# EAGLE design BOTS_Latch (EAGLE 9.2.2)
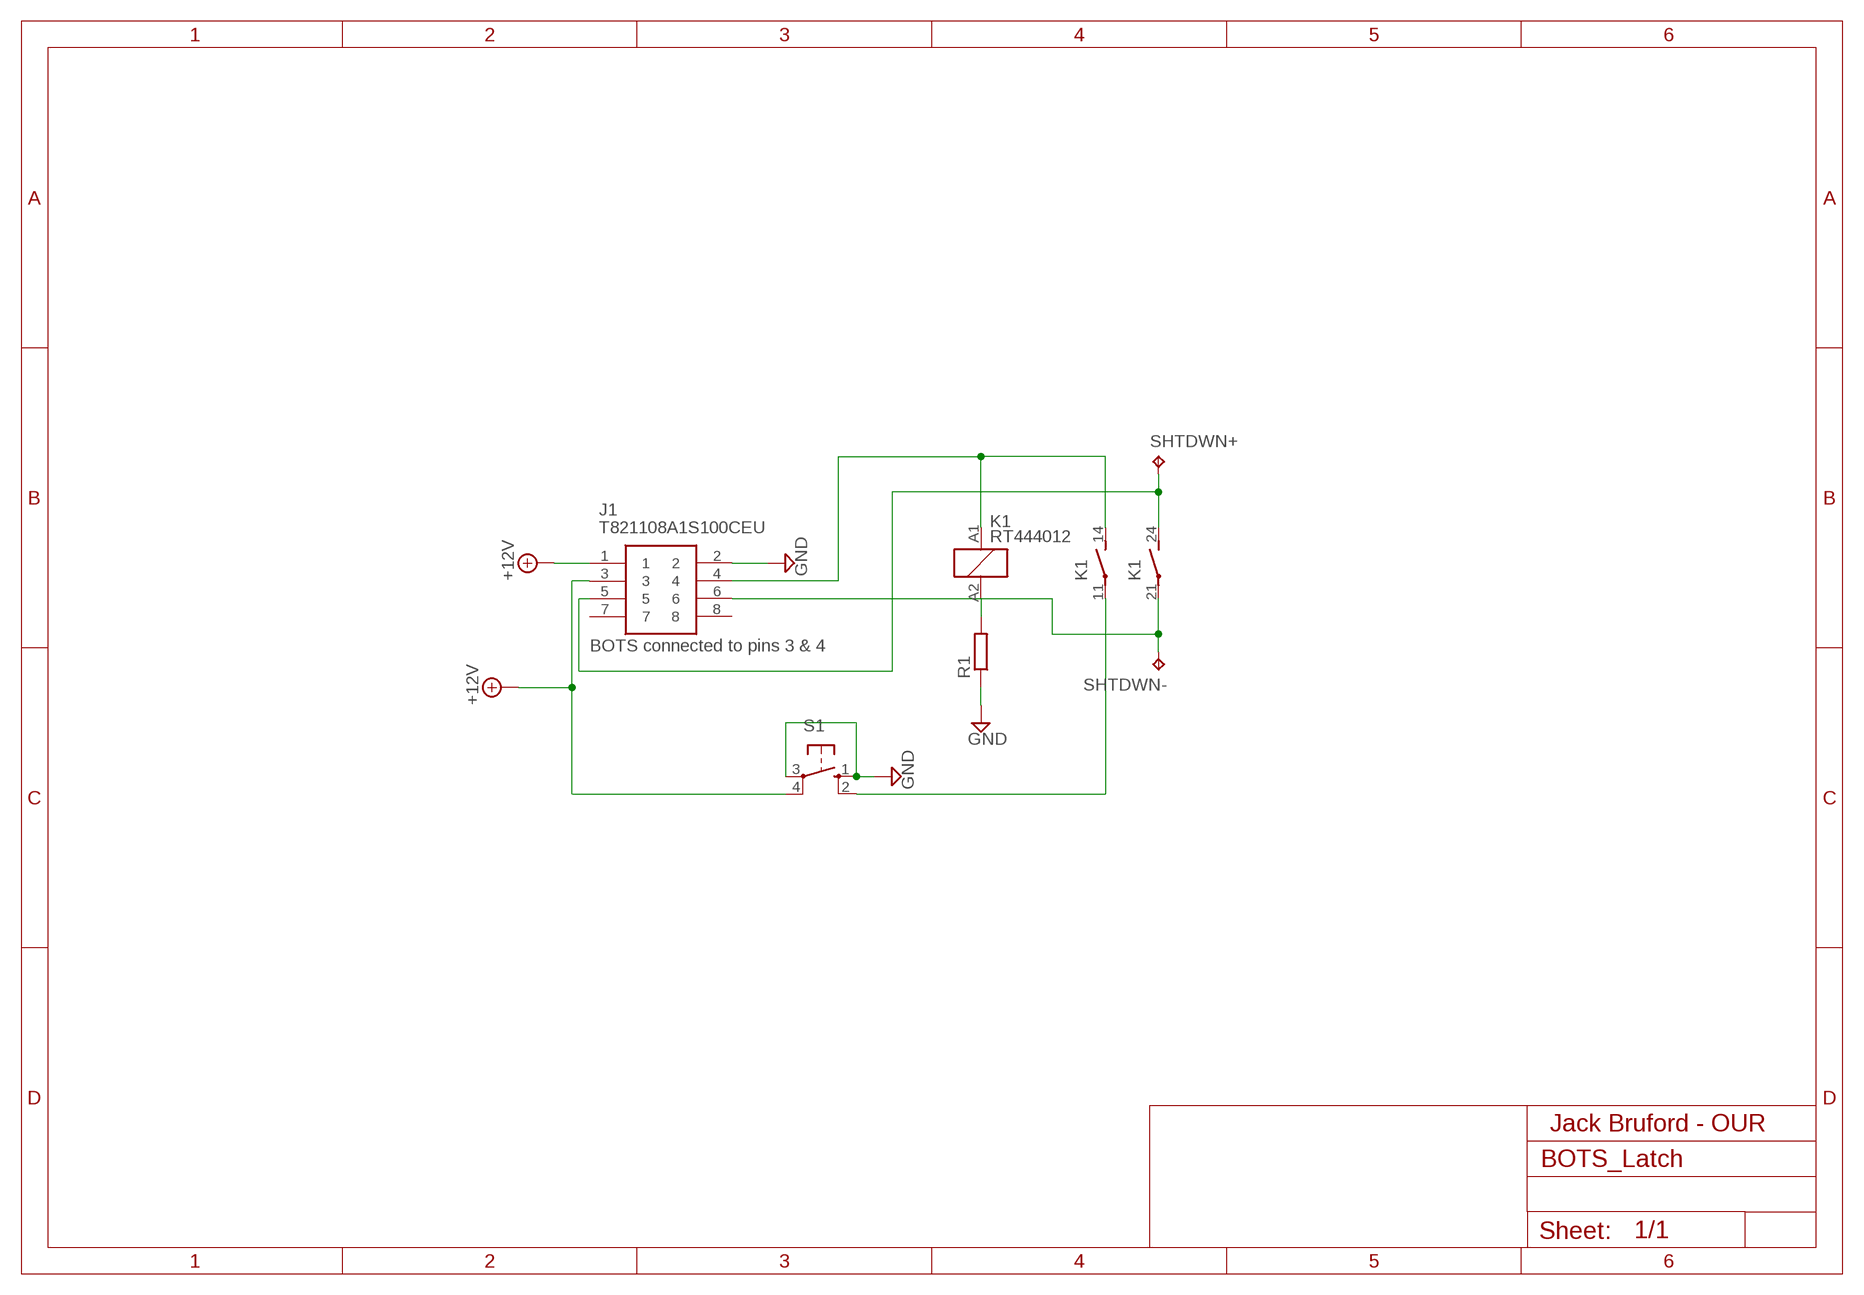
[diagram p0: schematic, sheet 1]

## Parts
J1  T821108A1S100CEU  [HDRV8W64P254_2X4_1778X895X915P]
K1  RT444012  [RT2N/O]
R1  R-EU_0207/15  [0207/15]
S1  10-XX  [B3F-10XX]
SHTDWN+  TPPAD1-13  [P1-13]
SHTDWN-  TPPAD1-13  [P1-13]

## Nets
+12V: J1.1 J1.3 S1.4(P1)
GND: J1.2 R1.1 S1.1(S) S1.3(P)
N$1: K1.11(2:P) S1.2(S1)
N$2: K1.A2 R1.2
N$3: J1.5 K1.24(3:S) SHTDWN+.TP
N$4: J1.6 K1.21(3:P) SHTDWN-.TP
N$5: J1.4 K1.14(2:S) K1.A1
Unconnected: J1.7 J1.8

## Notes on the sheet
- BOTS connected to pins 3 & 4
- Jack Bruford - OUR

## Library data of the parts
J1 = T821108A1S100CEU:T821108A1S100CEU: HEADER, VERTICAL, 2.54MM, 8WAY Amphenol T821 Series, 2.54mm Pitch 8 Way 2 Row Straight PCB Header, Solder Termination, 3A Source: Datasheet <http://uk.rs-online.com/web/p/products/1702738>; DESCRIPTION: HEADER, VERTICAL, 2.54MM, 8WAY Amphenol T821 Series, 2.54mm Pitch 8 Way 2 Row Straight PCB Header, Solder Termination, 3A; HEIGHT: 9.15mm; MANUFACTURER_NAME: Amphenol; MANUFACTURER_PART_NUMBER: T821108A1S100CEU; RS_PART_NUMBER: 1702738
K1 = relay:RT44?*: Power PCB Relay SCHRACK 2 pole 8 A, DC and AC-coil Source: http://www.schrack.com/.. 5842.pdf; OC_FARNELL: unknown; OC_NEWARK: unknown
R1 = rcl:R-EU_: RESISTOR, European symbol; SPICEPREFIX: R
S1 = switch-omron:10-XX: OMRON SWITCH; MPN: B3F-1000; OC_FARNELL: 176432; OC_NEWARK: 36M3542
SHTDWN+ SHTDWN- = testpad:TP: Test pad

## Board
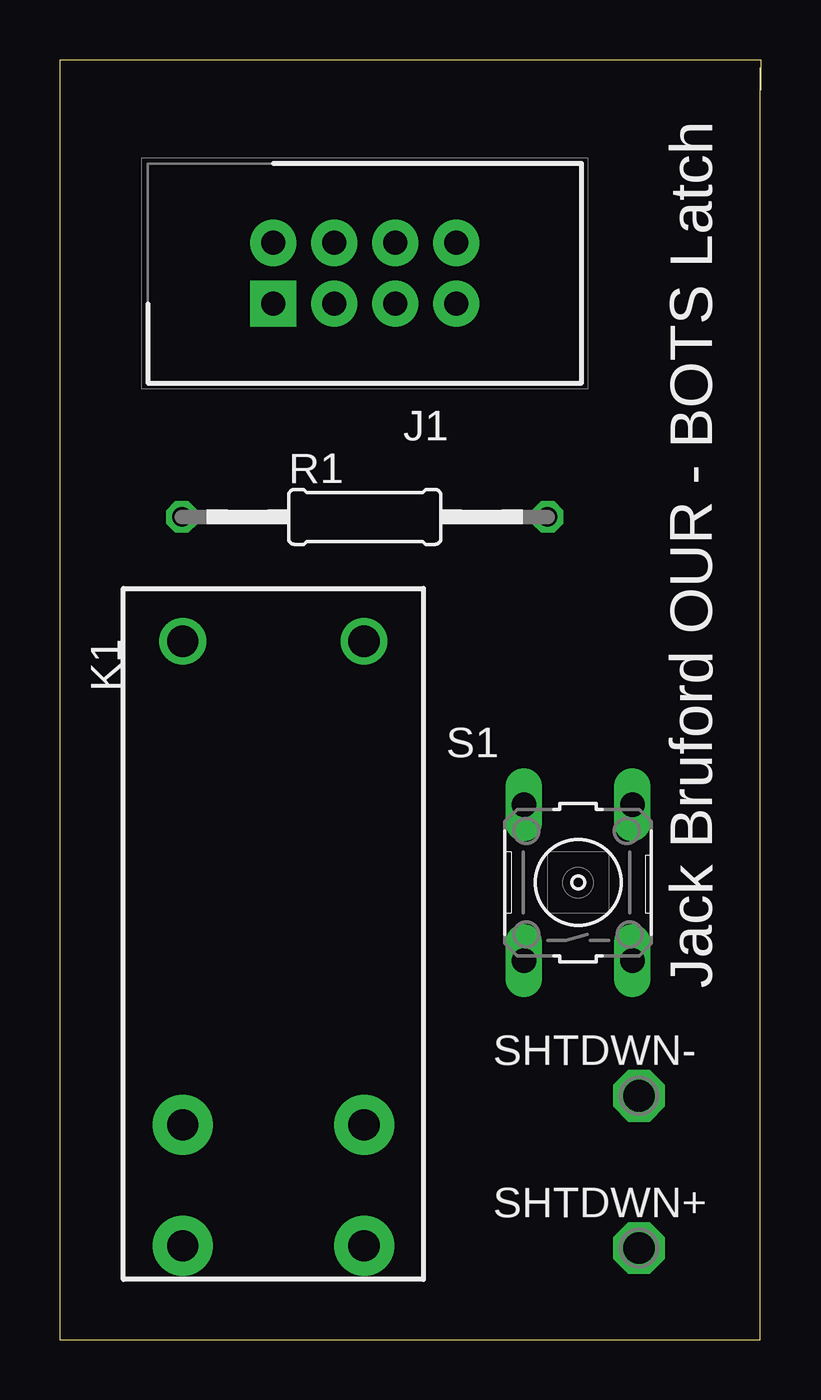
[diagram p1: board, top side]
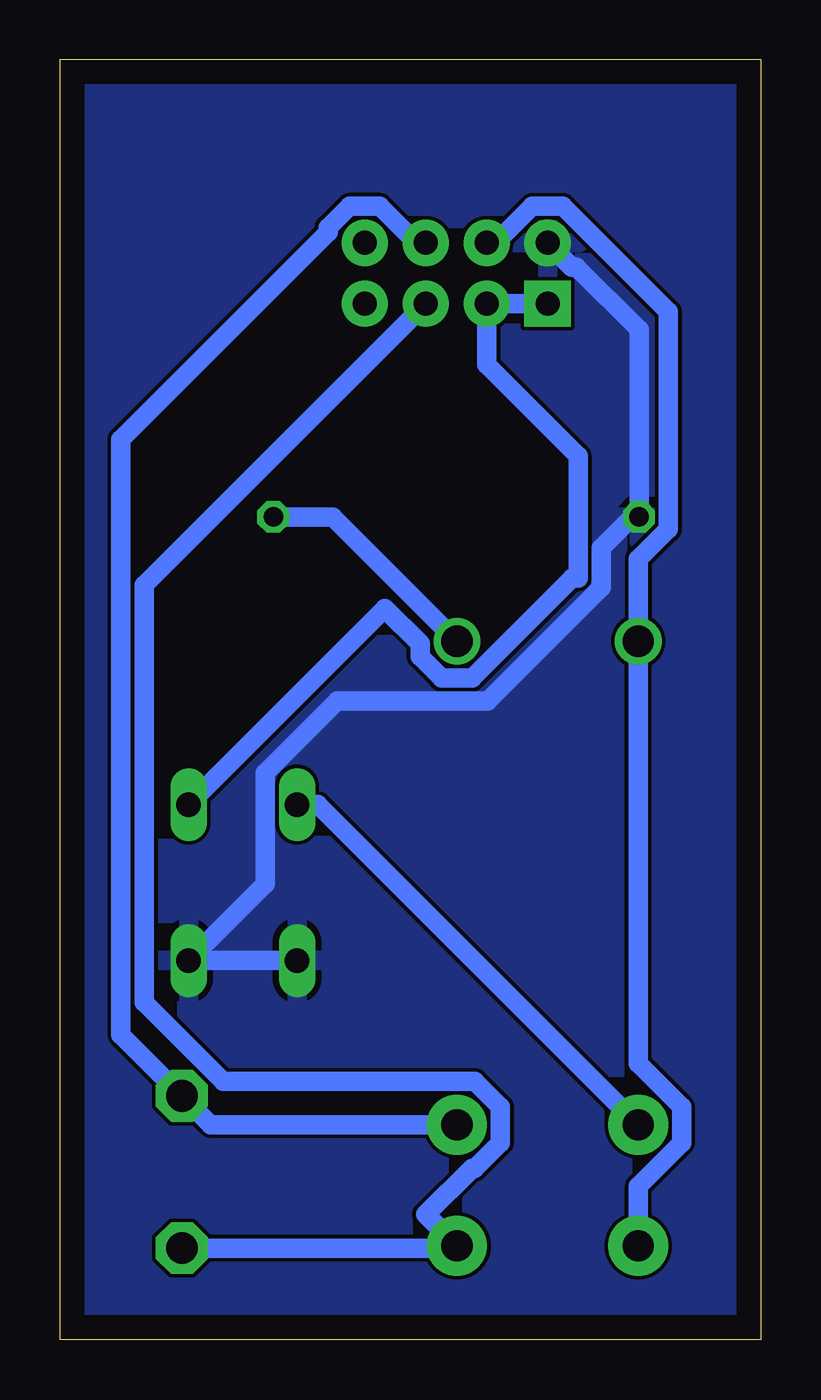
[diagram p2: board, bottom side, seen from below]

Size 29.21 x 53.34 mm. Coordinates in mm from the lower left corner, seen from the top.
Outline: 29.19,53.01 29.19,0 0,0 0,50.8
Outline: 0,53.01 0,50.8
Outline: 0,50.8 0,53.34 29.21,53.34 29.21,52.07
Copper layers (1*16): Top 0.035mm / dielectric 1.5mm / Bottom 0.035mm
Design rules "default": minimum track width 6mil, minimum drill 0.35mm, track to track 6mil, track to pad 6mil, pad to pad 6mil, via to via 6mil, smd to smd 6mil, copper to edge 40mil, drill to drill 6mil, minimum pad ring 10mil, minimum via ring 8mil, stop-mask expansion 4mil, vias tented up to drill 0mil, thermal gap 10mil

### Footprints (pad centres in the part's own frame; a part is rotated, then mirrored left to right if it is on the bottom)
HDRV8W64P254_2X4_1778X895X915P = drill 1 pad 1.93 square: 1 0,0 | drill 1 pad 1.93: 2 0,2.54; 3 2.54,0; 4 2.54,2.54; 5 5.08,0; 6 5.08,2.54; 7 7.62,0; 8 7.62,2.54
RT2N/O = drill 1.3 pad 2.5: 11 7.56,-3.78; 14 12.6,-3.78; 21 7.56,3.78; 24 12.6,3.78 | drill 1.3: A1 -12.6,-3.78; A2 -12.6,3.78
0207/15 = drill 0.813 octagon: 1 -7.62,0; 2 7.62,0
B3F-10XX = drill 1.016 long: 1 -3.251,2.261; 2 3.251,2.261; 3 -3.251,-2.261; 4 3.251,-2.261
P1-13 = drill 1.321 pad 2.159 octagon: TP 0,0

### Placement (x,y rotation side)
J1  8.89,43.18 0 top
K1  8.89,16.51 270 top
R1  12.7,34.29 0 top
S1  21.59,19.05 90 top
SHTDWN+  24.13,3.81 0 top
SHTDWN-  24.13,10.16 0 top

### Tracks (layer width: path | path; a pad name or v marks a point on that pad's centre or on a via)
+12V
  Bottom 0.813: S1.4 15.67,30.48 14.2,29.01 14.2,28.48 13.3,27.58 12.04,27.58 7.86,31.75 7.62,31.75 7.62,36.83 11.43,40.64 J1.3 J1.1
GND
  Bottom 0.813: S1.1 S1.3 20.65,19 20.65,23.61 17.65,26.61 11.39,26.61 6.66,31.35 6.66,32.99 5.36,34.29 R1.1 5.08,42.09 7.69,44.7 7.87,44.7 J1.2
  pour Bottom: 0,0 29.21,0 29.21,53.34 0,53.34
N$1
  Bottom 0.813: K1.11 18.46,22.3 S1.2
N$2
  Bottom 0.813: K1.A2 17.85,34.29 R1.2
N$3
  Bottom 0.813: SHTDWN+.TP 12.77,3.81 K1.24 13.97,5.21 12.04,7.14 11.92,7.14 10.86,8.2 10.86,9.7 11.92,10.76 22.41,10.76 25.7,14.05 25.7,31.45 J1.5
N$4
  Bottom 0.813: K1.21 22.92,8.95 SHTDWN-.TP 26.67,12.7 26.67,37.52 18.03,46.15 18.03,46.35 17.14,47.24 15.88,47.24 14.36,45.72 J1.6
N$5
  Bottom 0.813: K1.14 5.11,6.39 3.3,8.2 3.3,9.7 5.11,11.51 K1.A1 5.11,32.54 3.86,33.78 3.86,42.85 8.26,47.24 9.52,47.24 11.04,45.72 J1.4

### Text on the board
tPlace: Jack Bruford OUR - BOTS Latch